# EAGLE design BT_displej_rizeni_v3 (EAGLE 6.5.0)
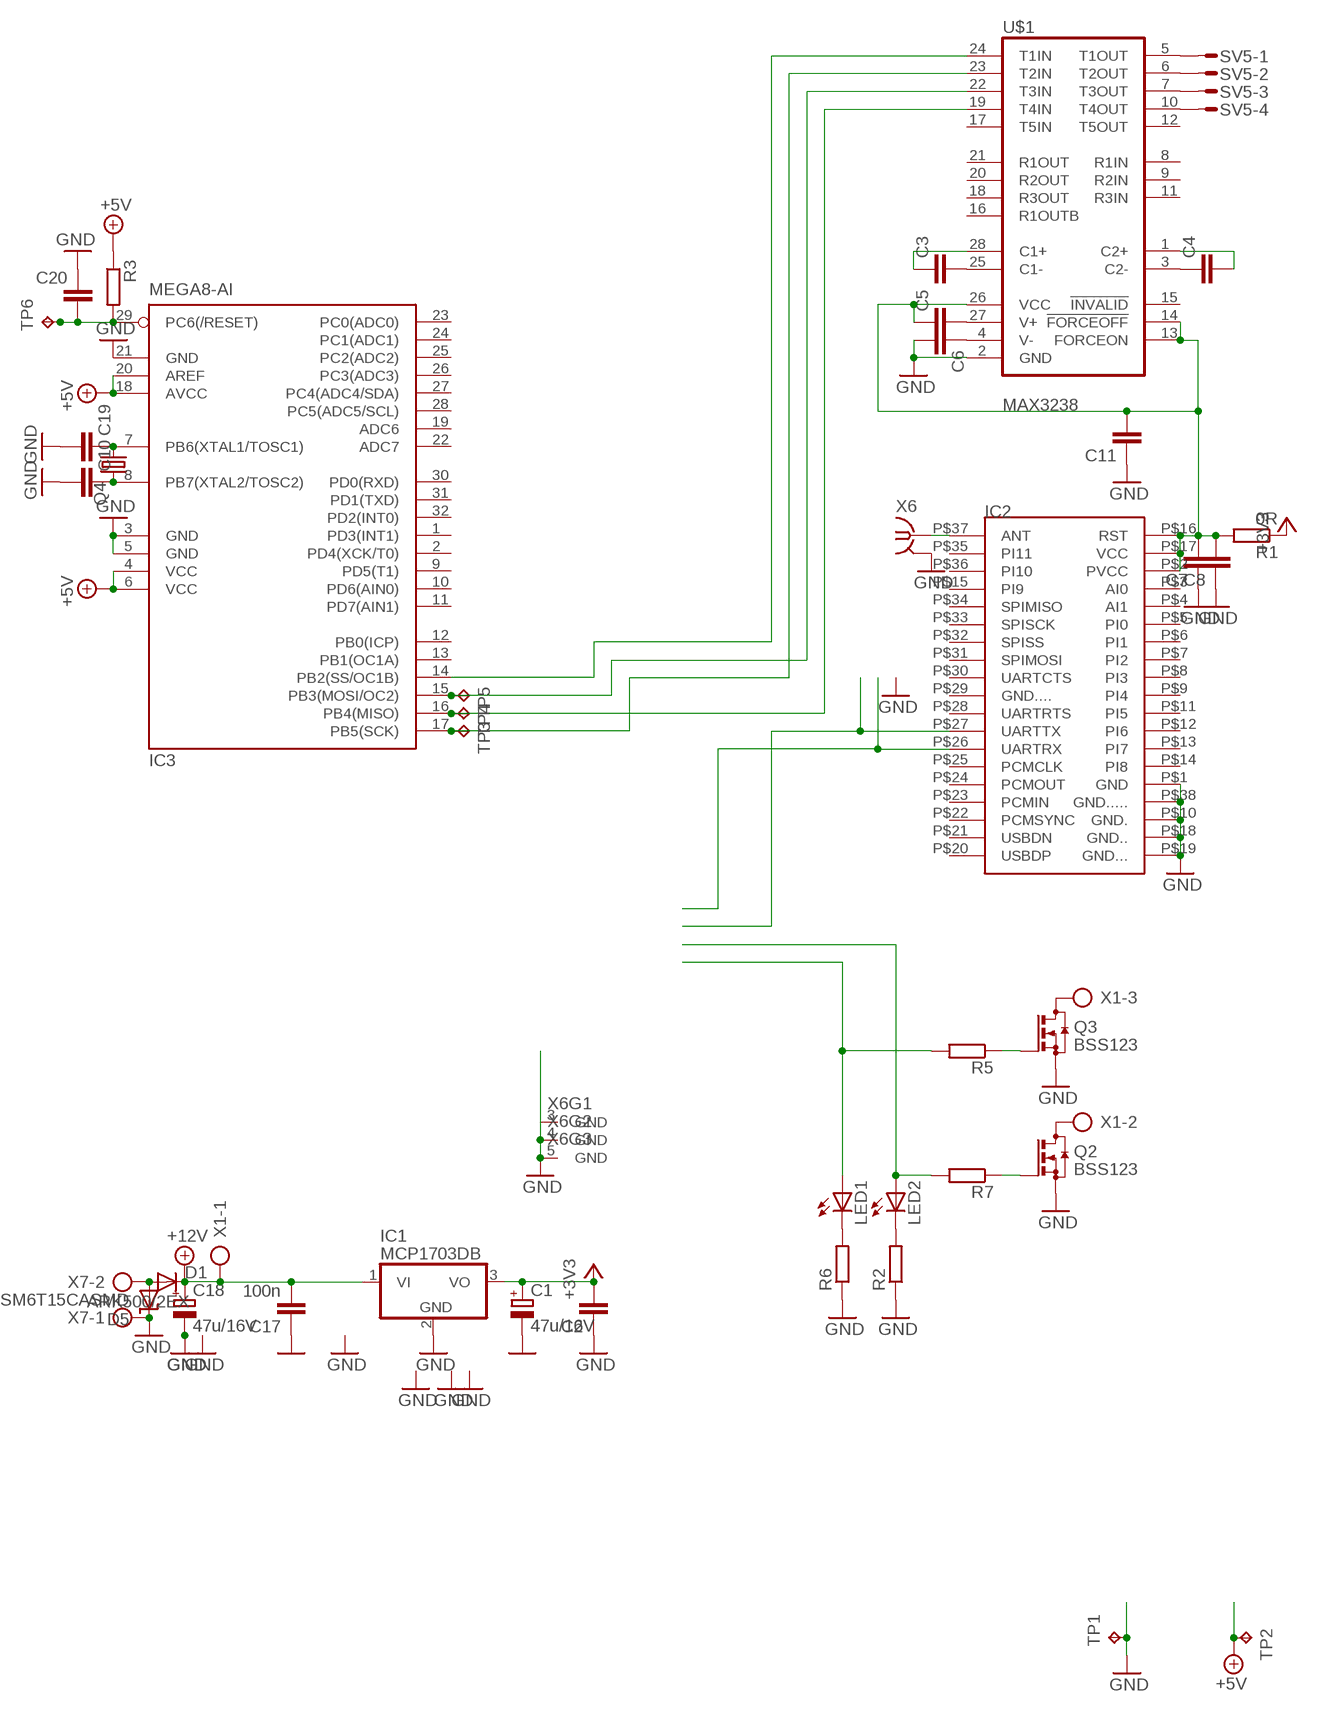
[diagram p0: schematic, sheet 1]

## Parts
C1  47u/16V  CPOL-EUSMCC  [SMC_C]
C2  C-EUC0603  [C0603]
C3  C-EUC0603  [C0603]
C4  C-EUC0603  [C0603]
C5  C-EUC0603  [C0603]
C6  C-EUC0603  [C0603]
C7  C-EUC0603  [C0603]
C8  C-EUC0603  [C0603]
C10  C-EUC0603  [C0603]
C11  C-EUC0603  [C0603]
C17  100n  C-EUC0603  [C0603]
C18  47u/16V  CPOL-EUSMCC  [SMC_C]
C19  C-EUC0603  [C0603]
C20  C-EUC0603  [C0603]
D1  DIODE-DO214AC  [DO214AC]
D5  SM6T15CASMD  SUPPRESSOR-SMBJ  [SMBJ]
IC1  MCP1703DB  [SOT223]
IC2  BT220  [B_DIL]
IC3  MEGA8-AI  [TQFP32-08]
LED1  LEDCHIP-LED0805  [CHIP-LED0805]
LED2  LEDCHIP-LED0805  [CHIP-LED0805]
Q2  BSS123  [SOT23]
Q3  BSS123  [SOT23]
Q4  CRYSTALCTS406  [CTS406]
R1  0R  R-EU_R0603  [R0603]
R2  R-EU_R0603  [R0603]
R3  R-EU_R0603  [R0603]
R5  R-EU_R0603  [R0603]
R6  R-EU_R0603  [R0603]
R7  R-EU_R0603  [R0603]
SV5  S04P  [S04P]
TP1  TPB1,27  [B1,27]
TP2  TPB1,27  [B1,27]
TP3  TPB1,27  [B1,27]
TP4  TPB1,27  [B1,27]
TP5  TPB1,27  [B1,27]
TP6  TPB1,27  [B1,27]
U$1  MAX3238  [SSOP28]
X1  AK500/3  [AK500/3]
X6  BU-SMA-V  [BU-SMA-V]
X7  ARK500/2EX  AK500/2  [AK500/2]

## Nets
+3V3: C1.+ C2.2 IC1.3(VO) R1.1
+5V: IC3.4(VCC) IC3.6(VCC) IC3.18(AVCC) IC3.20(AREF) R3.1 TP2.TP
+12V: C17.2 C18.+ D1.C IC1.1(VI) X1.1
GND: C1.- C2.1 C6.2 C7.1 C8.1 C10.2 C11.1 C17.1 C18.- C19.2 C20.1 D5.C IC1.2(GND) IC2.P$1(GND) IC2.P$10(GND.) IC2.P$18(GND..) IC2.P$19(GND...) IC2.P$38(GND.....) IC3.3(GND) IC3.5(GND) IC3.21(GND) Q2.2(S) Q3.2(S) R2.1 R6.1 TP1.TP U$1.2(GND) X6.2(GND) X6.3(GND) X6.4(GND) X6.5(GND) X7.1
N$1: IC2.P$27(UARTTX)
N$2: SV5.1 U$1.5(T1OUT)
N$3: LED2.C R2.2
N$4: Q3.1(G) R5.1
N$5: IC2.P$26(UARTRX)
N$6: D1.A D5.A X7.2
N$9: LED1.C R6.2
N$10: LED1.A R5.2
N$11: LED2.A R7.2
N$12: Q3.3(D) X1.3
N$13: Q2.3(D) X1.2
N$15: Q2.1(G) R7.1
N$20: SV5.2 U$1.6(T2OUT)
N$21: SV5.3 U$1.7(T3OUT)
N$22: SV5.4 U$1.10(T4OUT)
N$23: C3.2 U$1.25(C1-)
N$24: IC3.14(PB2(SS/OC1B)) U$1.24(T1IN)
N$25: C4.1 U$1.3(C2-)
N$26: C3.1 U$1.28(C1+)
N$27: IC3.17(PB5(SCK)) TP3.TP U$1.23(T2IN)
N$28: IC3.15(PB3(MOSI/OC2)) TP5.TP U$1.22(T3IN)
N$29: IC3.16(PB4(MISO)) TP4.TP U$1.19(T4IN)
N$30: C4.2 U$1.1(C2+)
N$31: C5.2 U$1.27(V+)
N$32: C6.1 U$1.4(V-)
N$33: C5.1 C7.2 C8.2 C11.2 IC2.P$2(PVCC) IC2.P$16(RST) IC2.P$17(VCC) R1.2 U$1.13(FORCEON) U$1.14(!FORCEOFF) U$1.26(VCC)
N$34: IC2.P$37(ANT) X6.1
N$39: C10.1 IC3.8(PB7(XTAL2/TOSC2)) Q4.3
N$40: C19.1 IC3.7(PB6(XTAL1/TOSC1)) Q4.1
N$44: C20.2 IC3.29(PC6(/RESET)) R3.2 TP6.TP
Unconnected: IC2.P$3(AI0) IC2.P$4(AI1) IC2.P$5(PI0) IC2.P$6(PI1) IC2.P$7(PI2) IC2.P$8(PI3) IC2.P$9(PI4) IC2.P$11(PI5) IC2.P$12(PI6) IC2.P$13(PI7) IC2.P$14(PI8) IC2.P$15(PI9) IC2.P$20(USBDP) IC2.P$21(USBDN) IC2.P$22(PCMSYNC) IC2.P$23(PCMIN) IC2.P$24(PCMOUT) IC2.P$25(PCMCLK) IC2.P$28(UARTRTS) IC2.P$29(GND....) IC2.P$30(UARTCTS) IC2.P$31(SPIMOSI) IC2.P$32(SPISS) IC2.P$33(SPISCK) IC2.P$34(SPIMISO) IC2.P$35(PI11) IC2.P$36(PI10) IC3.1(PD3(INT1)) IC3.2(PD4(XCK/T0)) IC3.9(PD5(T1)) IC3.10(PD6(AIN0)) IC3.11(PD7(AIN1)) IC3.12(PB0(ICP)) IC3.13(PB1(OC1A)) IC3.19(ADC6) IC3.22(ADC7) IC3.23(PC0(ADC0)) IC3.24(PC1(ADC1)) IC3.25(PC2(ADC2)) IC3.26(PC3(ADC3)) IC3.27(PC4(ADC4/SDA)) IC3.28(PC5(ADC5/SCL)) IC3.30(PD0(RXD)) IC3.31(PD1(TXD)) IC3.32(PD2(INT0)) U$1.8(R1IN) U$1.9(R2IN) U$1.11(R3IN) U$1.12(T5OUT) U$1.15(!INVALID) U$1.16(R1OUTB) U$1.17(T5IN) U$1.18(R3OUT) U$1.20(R2OUT) U$1.21(R1OUT)

## Library data of the parts
C1 C18 = rcl:CPOL-EU: POLARIZED CAPACITOR, European symbol
C2-C8 C10 C11 C17 C19 C20 = rcl:C-EU: CAPACITOR, European symbol
D1 = diode:DIODE-: DIODE
D5 = diode:SUPPRESSOR-: Suppressor diode
IC1 = linear:MCP1703: 250 mA, 16V, Low Quiescent Current LDO Regulator Source: http://ww1.microchip.com/downloads/en/DeviceDoc/22049b.pdf
IC2 = Bluetooth:BT220
IC3 = atmel:MEGA8: MICROCONTROLLER 8 Kbytes FLASH, 1 kbytes SRAM, 512 bytes EEPROM, USART, 6-channel 10 bit ADC, 2-channel 8 bit ADC Pin compatible with Atmega48, ATMega88, ATMega168 Source: avr.lbr
LED1 LED2 = led:LED: LED OSRAM: - CHIPLED LG R971, LG N971, LY N971, LG Q971, LY Q971, LO R971, LY R971 LH N974, LH R974 LS Q976, LO Q976, LY Q976 LO Q996 - Hyper CHIPLED LW Q18S LB Q993, LB Q99A, LB R99A - SideLED LS A670, LO A670, LY A670, LG A670, LP A670 LB A673, LV A673, LT A673, LW A673 LH A674 LY A675 LS A676, LA A676, LO A676, LY A676, LW A676 LS A679, LY A679, LG A679 - Hyper Micro SIDELED® LS Y876, LA Y876, LO Y876, LY Y876 LT Y87S - SmartLED LW L88C, LW L88S LB L89C, LB L89S, LG L890 LS L89K, LO L89K, LY L89K LS L896, LA L896, LO L896, LY L896 - TOPLED LS T670, LO T670, LY T670, LG T670, LP T670 LSG T670, LSP T670, LSY T670, LOP T670, LYG T670 LG T671, LOG T671, LSG T671 LB T673, LV T673, LT T673, LW T673 LH T674 LS T676, LA T676, LO T676, LY T676, LB T676, LH T676, LSB T676, LW T676 LB T67C, LV T67C, LT T67C, LS T67K, LO T67K, LY T67K, LW E67C LS E67B, LA E67B, LO E67B, LY E67B, LB E67C, LV E67C, LT E67C LW T67C LS T679, LY T679, LG T679 LS T770, LO T770, LY T770, LG T770, LP T770 LB T773, LV T773, LT T773, LW T773 LH T774 LS E675, LA E675, LY E675, LS T675 LS T776, LA T776, LO T776, LY T776, LB T776 LHGB T686 LT T68C, LB T68C - Hyper Mini TOPLED® LB M676 - Mini TOPLED Santana® LG M470 LS M47K, LO M47K, LY M47K Source: http://www.osram.convergy.de LUXEON: - LUMILED® LXK2-PW12-R00, LXK2-PW12-S00, LXK2-PW14-U00, LXK2-PW14-V00 LXK2-PM12-R00, LXK2-PM12-S00, LXK2-PM14-U00 LXK2-PE12-Q00, LXK2-PE12-R00, LXK2-PE12-S00, LXK2-PE14-T00, LXK2-PE14-U00 LXK2-PB12-K00, LXK2-PB12-L00, LXK2-PB12-M00, LXK2-PB14-N00, LXK2-PB14-P00, LXK2-PB14-Q00 LXK2-PR12-L00, LXK2-PR12-M00, LXK2-PR14-Q00, LXK2-PR14-R00 LXK2-PD12-Q00, LXK2-PD12-R00, LXK2-PD12-S00 LXK2-PH12-R00, LXK2-PH12-S00 LXK2-PL12-P00, LXK2-PL12-Q00, LXK2-PL12-R00 Source: www.luxeon.com KINGBRIGHT: KA-3528ASYC Source: www.kingbright.com
Q2 Q3 = transistor-small-signal:BSS123: N-CHANNEL MOS FET
Q4 = crystal:CRYSTAL: CRYSTAL; OC_FARNELL: unknown; OC_NEWARK: unknown
R1-R3 R5-R7 = rcl:R-EU_: RESISTOR, European symbol
SV5 = con-amp-mt:S04P: AMP MT CONNECTOR
TP1-TP6 = testpad:TP: Test pad
U$1 = max3238:MAX3238
X1 = con-ptr500:AK500/3: CONNECTOR
X6 = con-coax:BU-SMA-V: FEMALE SMA CONNECTOR Radiall distributor RS 112-3794
X7 = con-ptr500:AK500/2: CONNECTOR

## Board
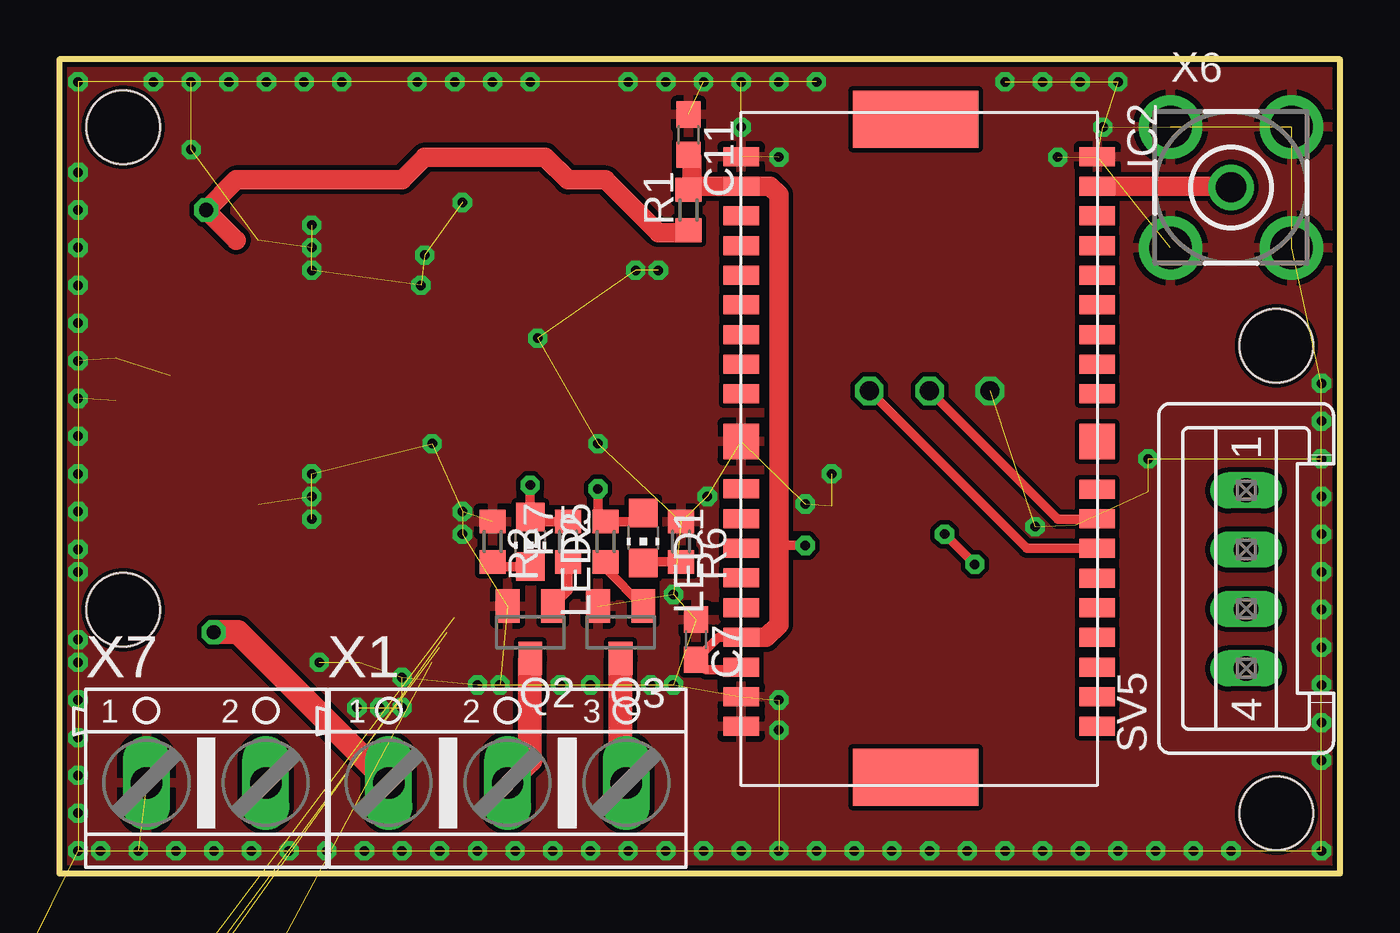
[diagram p1: board, top side]
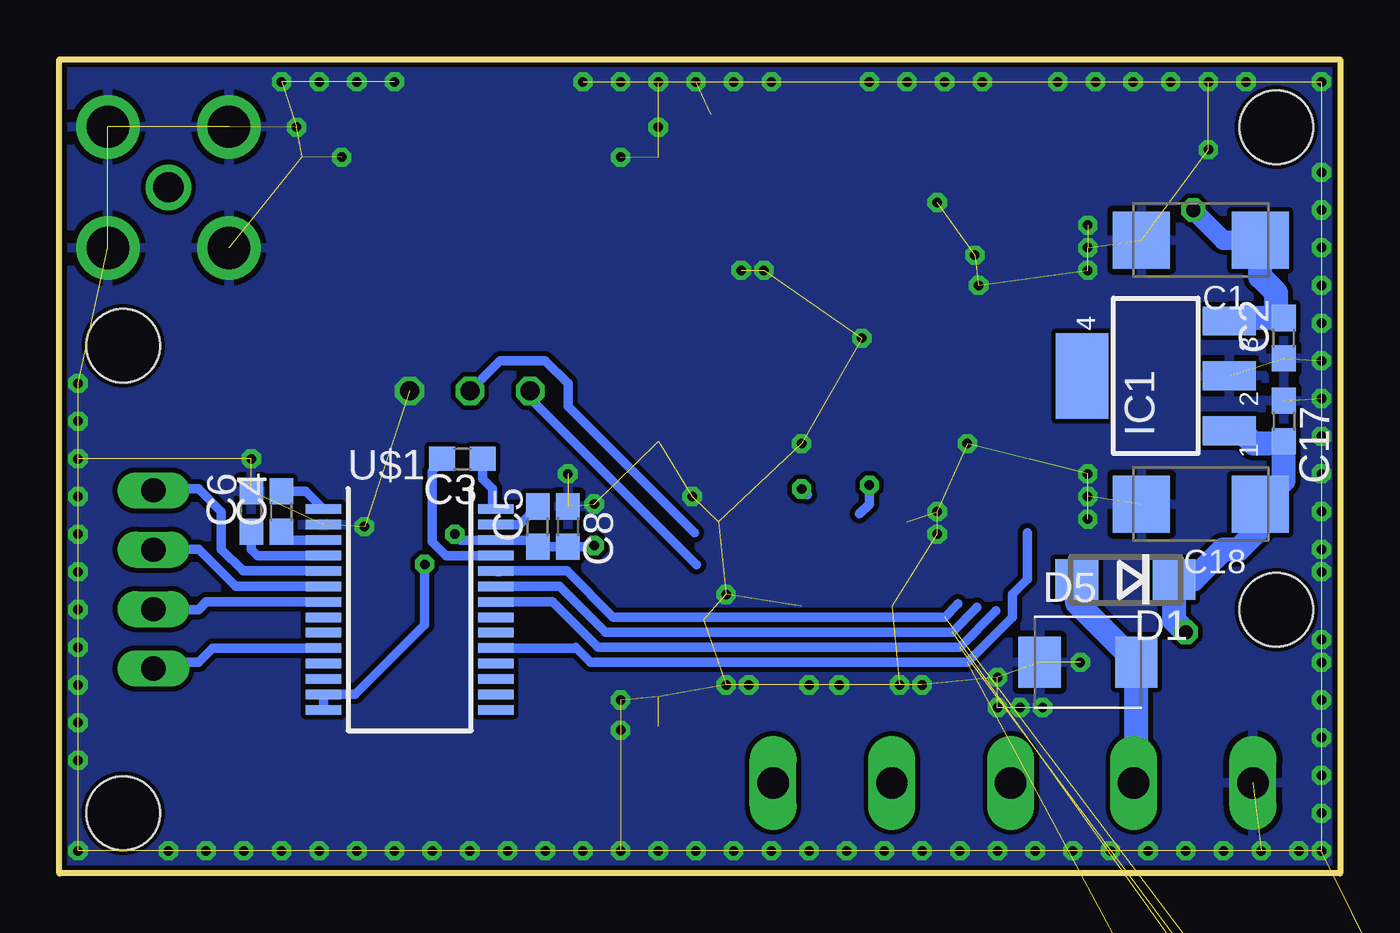
[diagram p2: board, bottom side, seen from below]

Size 53.96 x 34.28 mm. Coordinates in mm from the lower left corner, seen from the top.
Outline: 0,0 53.96,0 53.96,34.28 0,34.28 0,0
Copper layers (1*16): Top 0.035mm / dielectric 1.5mm / Bottom 0.035mm
Design rules "default *": minimum track width 10mil, minimum drill 0.35mm, track to track 8mil, track to pad 8mil, pad to pad 8mil, via to via 8mil, smd to smd 8mil, copper to edge 0.2mm, drill to drill 8mil, minimum pad ring 10mil, minimum via ring 8mil, stop-mask expansion 4mil, vias tented up to drill 0.6mm, thermal gap 10mil
Holes 3.1 mm at 51.27,22.22 2.69,31.43 51.27,2.54 2.69,11.11

### Footprints (pad centres in the part's own frame; a part is rotated, then mirrored left to right if it is on the bottom)
SMC_C = smd 2.4 x 2.4: + -2.5,0; - 2.5,0
C0603 = smd 1.1 x 1: 1 -0.85,0; 2 0.85,0
DO214AC = smd 1.8 x 1.7: A 2.05,0; C -2.05,0
SMBJ = smd 1.78 x 2.16: A 2.04,0; C -2.03,0
SOT223 = smd 1.219 x 2.235: 1 -2.311,-3.099; 2 0,-3.099; 3 2.311,-3.099 | smd 3.6 x 2.2: 4 0,3.099
B_DIL = smd 0.8 x 1.5: P$1 -14,0; P$2 -12.75,0; P$3 -11.5,0; P$4 -10.25,0; P$5 -9,0; P$6 -7.75,0; P$7 -6.5,0; P$8 -5.25,0; P$9 -4,0; P$11 0,0; P$12 1.25,0; P$13 2.5,0; P$14 3.75,0; P$15 5,0; P$16 6.25,0; P$17 7.5,0; P$18 8.75,0; P$19 10,0; P$20 10.004,15; P$21 8.754,15; P$22 7.504,15; P$23 6.254,15; P$24 5.004,15; P$25 3.754,15; P$26 2.504,15; P$27 1.254,15; P$28 0.004,15; P$30 -4,15; P$31 -5.25,15; P$32 -6.5,15; P$33 -7.75,15; P$34 -9,15; P$35 -10.25,15; P$36 -11.5,15; P$37 -12.75,15; P$38 -14,15 | smd 1.5 x 1.5: P$10 -2,0; P$29 -2,15 | smd 2.4 x 5.3: P$39 -15.575,7.35; P$40 12.15,7.35
TQFP32-08 = smd 1.27 x 0.559: 1 -4.293,2.8; 2 -4.293,2; 3 -4.293,1.2; 4 -4.293,0.4; 5 -4.293,-0.4; 6 -4.293,-1.2; 7 -4.293,-2; 8 -4.293,-2.8; 17 4.293,-2.8; 18 4.293,-2; 19 4.293,-1.2; 20 4.293,-0.4; 21 4.293,0.4; 22 4.293,1.2; 23 4.293,2; 24 4.293,2.8 | smd 0.559 x 1.27: 9 -2.8,-4.293; 10 -2,-4.293; 11 -1.2,-4.293; 12 -0.4,-4.293; 13 0.4,-4.293; 14 1.2,-4.293; 15 2,-4.293; 16 2.8,-4.293; 25 2.8,4.293; 26 2,4.293; 27 1.2,4.293; 28 0.4,4.293; 29 -0.4,4.293; 30 -1.2,4.293; 31 -2,4.293; 32 -2.8,4.293
CHIP-LED0805 = smd 1.2 x 1.2: A 0,-1.05; C 0,1.05
SOT23 = smd 1 x 1.4: 1 -0.95,-1.1; 2 0.95,-1.1; 3 0,1.1
CTS406 = smd 1.9 x 1.4: 1 -2.2,-1.2; 2 2.2,-1.2; 3 2.2,1.2; 4 -2.2,1.2
R0603 = smd 1 x 1.1: 1 -0.85,0; 2 0.85,0
S04P = drill 1.016 long: 1 3.75,0; 2 1.25,0; 3 -1.25,0; 4 -3.75,0
B1,27 = smd 1.27 x 1.27: TP 0,0
SSOP28 = smd 0.4 x 1.5: 1 2.125,2.725; 2 2.775,2.725; 3 3.425,2.725; 4 4.075,2.725; 5 4.725,2.725; 6 5.375,2.725; 7 6.025,2.725; 8 6.675,2.725; 9 7.325,2.725; 10 7.975,2.725; 11 8.625,2.725; 12 9.275,2.725; 13 9.925,2.725; 14 10.575,2.725; 15 10.575,9.975; 16 9.925,9.975; 17 9.275,9.975; 18 8.625,9.975; 19 7.975,9.975; 20 7.325,9.975; 21 6.675,9.975; 22 6.025,9.975; 23 5.375,9.975; 24 4.725,9.975; 25 4.075,9.975; 26 3.425,9.975; 27 2.775,9.975; 28 2.125,9.975
AK500/3 = drill 1.321 long: 1 -5.004,0; 2 0,0; 3 5.004,0
BU-SMA-V = drill 1.27: 1 0,0 | drill 1.778: 2 -2.55,2.55; 3 2.55,2.55; 4 2.55,-2.55; 5 -2.55,-2.55
AK500/2 = drill 1.321 long: 1 -2.515,0; 2 2.515,0

### Placement (x,y rotation side)
C1  5.87,26.66 180 bottom
C2  2.38,22.54 90 bottom
C3  36.98,17.46 180 bottom
C4  44.6,15.23 90 bottom
C5  33.81,14.6 90 bottom
C6  45.87,15.23 90 bottom
C7  26.82,9.84 270 top
C8  32.54,14.6 270 bottom
C10  -13.82,-42.23 0 top  (outside the outline)
C11  26.5,31.11 270 top
C17  2.38,19.05 270 bottom
C18  5.87,15.55 180 bottom
C19  -22.39,-46.36 0 top  (outside the outline)
C20  -17.63,-46.36 0 top  (outside the outline)
D1  9.04,12.38 180 bottom
D5  10.63,8.89 0 bottom
IC1  7.77,20.95 90 bottom
IC2  28.73,16.19 270 top
IC3  -18.9,-30.48 0 top  (outside the outline)
LED1  24.6,14.12 180 top
LED2  19.84,13.96 180 top
Q2  19.84,10.16 180 top
Q3  23.65,10.16 180 top
Q4  -10.32,-28.26 0 top  (outside the outline)
R1  26.5,27.94 90 top
R2  18.25,13.96 270 top
R3  -12.87,-46.36 0 top  (outside the outline)
R5  23.01,13.96 90 top
R6  26.19,13.96 270 top
R7  21.43,13.96 90 top
SV5  50,12.38 90 top
TP1  -23.02,-38.42 0 top  (outside the outline)
TP2  -18.58,-38.42 0 top  (outside the outline)
TP3  -14.13,-38.42 0 top  (outside the outline)
TP4  -9.69,-38.42 0 top  (outside the outline)
TP5  -23.02,-42.55 0 top  (outside the outline)
TP6  -18.58,-42.55 0 top  (outside the outline)
U$1  45.55,17.46 270 bottom
X1  18.89,3.8 0 top
X6  49.36,28.89 0 top
X7  6.18,3.8 0 top

### Tracks (layer width: path | path; a pad name or v marks a point on that pad's centre or on a via)
+3V3  (via drill 0.6)
  Top 0.406: R1.1 26.4,26.98
  Top 0.813: 7.46,26.66 v6.18,27.94 7.46,29.2 14.44,29.2 15.39,30.16 20.47,30.16 21.43,29.2 23.01,29.2 25.24,26.98 26.4,26.98
  Bottom 0.813: v6.18,27.94 4.91,26.66 C1.+
  Bottom 1.016: IC1.3 4.55,23.39 C2.2 2.69,23.7 2.69,24.44 3.37,25.12 C1.+
+5V  (5 unrouted)
+12V  (via drill 0.6)
  Top 1.016: X1.1 7.53,10.16 v6.5,10.16
  Bottom 1.016: IC1.1 4.19,18.64 3.64,18.09 2.48,18.09 C17.2 2.38,16.55 C18.+ 3.37,14.56 4.28,13.65 4.91,13.65 6.18,12.38 D1.C 6.99,10.64 v6.5,10.16
GND  (via drill 0.4, 0.8)  (155 unrouted)
  other vias: 16.98,15.23 16.98,14.28 15.71,18.09 24.28,25.4 25.24,25.4 20.15,22.54 22.69,18.09 39.2,20.31 32.54,16.82 31.43,15.55 30.32,6.03 30.32,7.3 41.11,14.6 45.87,17.46 10.63,16.82 10.63,15.87 10.63,14.92 14.44,8.25 14.44,6.98 13.49,6.98 12.54,6.98 10.95,8.89 10.63,26.35 10.63,27.3 10.63,25.4 0.79,27.94 5.55,30.48 0.79,29.52 15.39,26.03 16.98,28.25 15.23,24.76 25.87,11.74 27.3,15.87 42.06,30.16 30.32,30.16 28.73,31.43 43.97,31.43 0.79,33.33 3.96,33.33 5.55,33.33 7.14,33.33 8.73,33.33 10.31,33.33 11.9,33.33 16.66,33.33 15.07,33.33 18.25,33.33 19.84,33.33 23.96,33.33 25.55,33.33 27.14,33.33 28.73,33.33 30.32,33.33 31.9,33.33 39.84,33.33 41.43,33.33 43.02,33.33 44.6,33.33 53.17,15.87 53.17,17.46 53.17,19.05 53.17,20.63 53.17,9.52 53.17,11.11 53.17,12.7 53.17,14.28 53.17,0.95 53.17,4.76 53.17,6.34 53.17,7.93 38.25,0.95 39.84,0.95 41.43,0.95 43.02,0.95 44.6,0.95 46.19,0.95 47.78,0.95 49.36,0.95 0.79,0.95 1.74,0.95 3.33,0.95 4.91,0.95 6.5,0.95 8.09,0.95 9.68,0.95 11.27,0.95 12.85,0.95 14.44,0.95 16.03,0.95 17.61,0.95 19.2,0.95 20.79,0.95 22.38,0.95 23.96,0.95 25.55,0.95 27.14,0.95 28.73,0.95 30.32,0.95 31.9,0.95 33.49,0.95 35.08,0.95 36.67,0.95 0.79,15.23 0.79,16.82 0.79,18.41 0.79,20 0.79,21.59 0.79,23.17 0.79,24.76 0.79,26.35 0.79,2.54 0.79,4.12 0.79,5.71 0.79,7.3 0.79,8.89 0.79,9.84 0.79,12.7 0.79,13.65 18.57,7.93 21.11,7.93 22.38,7.93 24.92,7.93 25.87,7.93 17.61,7.93
  pour Bottom: -20.48,68.89 77.3,68.89 77.3,-20.64 -20.48,-20.64
  pour Top: -23.98,73.02 82.7,73.02 82.7,-23.82 -23.98,-23.82 -23.98,72.7
N$1  (via drill 0.8)
  Top 0.406: v36.67,20.31 42.06,14.92 43.71,14.92 IC2.P$27
  Bottom 0.406: 27.2,14.34 32.54,19.68 32.54,20.63 33.49,21.59 35.39,21.59 v36.67,20.31
N$2
  Bottom 0.406: U$1.5 46.23,12.73 47.14,13.65 47.14,15.23 48.09,16.19 49.94,16.19 SV5.1
N$3
  Top 0.406: R2.2 18.45,12.91 LED2.C
N$4
  Top 0.406: Q3.1 23.01,12.84 R5.1
N$5  (via drill 0.8)
  Top 0.406: IC2.P$26 40.76,13.68 v34.12,20.31
  Bottom 0.406: 27.12,12.99 34.12,20 v34.12,20.31
N$6
  Bottom 1.016: X7.2 8.59,3.91 D5.A 11.09,11.39 D1.A
N$9
  Top 0.406: LED1.C 24.8,13.11 R6.2
N$10  (via drill 0.4)
  Top 0.406: LED1.A 24.4,14.82 R5.2 22.69,15.13 v22.69,16.19
  Bottom 0.406: 22.45,15.94 v22.69,16.19
N$11  (via drill 0.4)
  Top 0.406: R7.2 20.04,14.82 LED2.A v19.84,16.35
  Bottom 0.406: 20.25,15.14 19.84,15.55 v19.84,16.35
N$12
  Top 1.016: X1.3 23.65,4.05 Q3.3
N$13
  Top 1.016: X1.2 19.84,4.76 Q2.3
N$15
  Top 0.406: Q2.1 21.43,11.89 R7.1
N$20
  Bottom 0.406: U$1.6 46.53,12.08 48.09,13.65 49.98,13.65 SV5.2
N$21
  Bottom 0.406: U$1.7 47.77,11.43 48.09,11.11 49.98,11.11 SV5.3
N$22
  Bottom 0.406: U$1.10 47.5,9.48 48.09,8.89 49.74,8.89 SV5.4
N$23
  Bottom 0.406: C3.2 38.25,16.92 38.25,13.96 37.67,13.38 U$1.25
N$24  (1 unrouted)
  Bottom 0.406: 35.39,12.7 35.54,12.7 U$1.24 32.58,12.73 30.63,10.79 16.66,10.79 16.1,11.36
N$25
  Bottom 0.406: C4.1 44.25,14.03 U$1.3
N$26
  Bottom 0.406: U$1.28 35.71,15.46 35.71,16.19 36.13,16.61 C3.1
N$27  (2 unrouted)
  Bottom 0.406: 15.3,11.2 16.35,10.16 30.95,10.16 32.88,12.08 U$1.23
N$28  (2 unrouted)
  Bottom 0.406: 14.5,11.05 16.03,9.52 31.27,9.52 33.18,11.43 U$1.22
N$29  (2 unrouted)
  Bottom 0.406: 13.17,14.34 13.17,12.38 13.81,11.74 13.81,10.79 15.71,8.89 31.58,8.89 32.22,9.52 32.26,9.48 U$1.19
N$30
  Bottom 0.406: U$1.1 43.58,16.09 C4.2
N$31
  Bottom 0.406: C5.2 34.58,14.68 U$1.27
N$32
  Bottom 0.406: U$1.4 45.61,13.38 45.87,13.65 C6.1
N$33  (via drill 0.4)
  Top 0.406: v37.3,14.28 v38.57,13.01 | R1.2 26.66,28.94 | IC2.P$17 28.85,8.57 27.24,8.57 C7.2 27.77,9.94 IC2.P$16 | v31.43,13.81 30.32,13.81
  Top 0.813: IC2.P$16 29.78,9.94 30.32,10.47 30.32,13.81 30.32,28.57 29.95,28.94 IC2.P$2 26.66,28.94 26.66,30.11 C11.2
  Bottom 0.406: U$1.14 U$1.13 41.51,7.53 38.57,10.47 v38.57,13.01 | v37.3,14.28 37.05,14.03 U$1.26 34.09,14.03 C5.1 C8.2 31.48,13.75 v31.43,13.81
N$34
  Top 0.813: IC2.P$37 49.31,28.94 X6.1
N$39  (2 unrouted)
N$40  (2 unrouted)
N$44  (3 unrouted)

### Text on the board
Measures: BT display | v2.0